# EAGLE schematic Schematic (EAGLE 9.7.0)
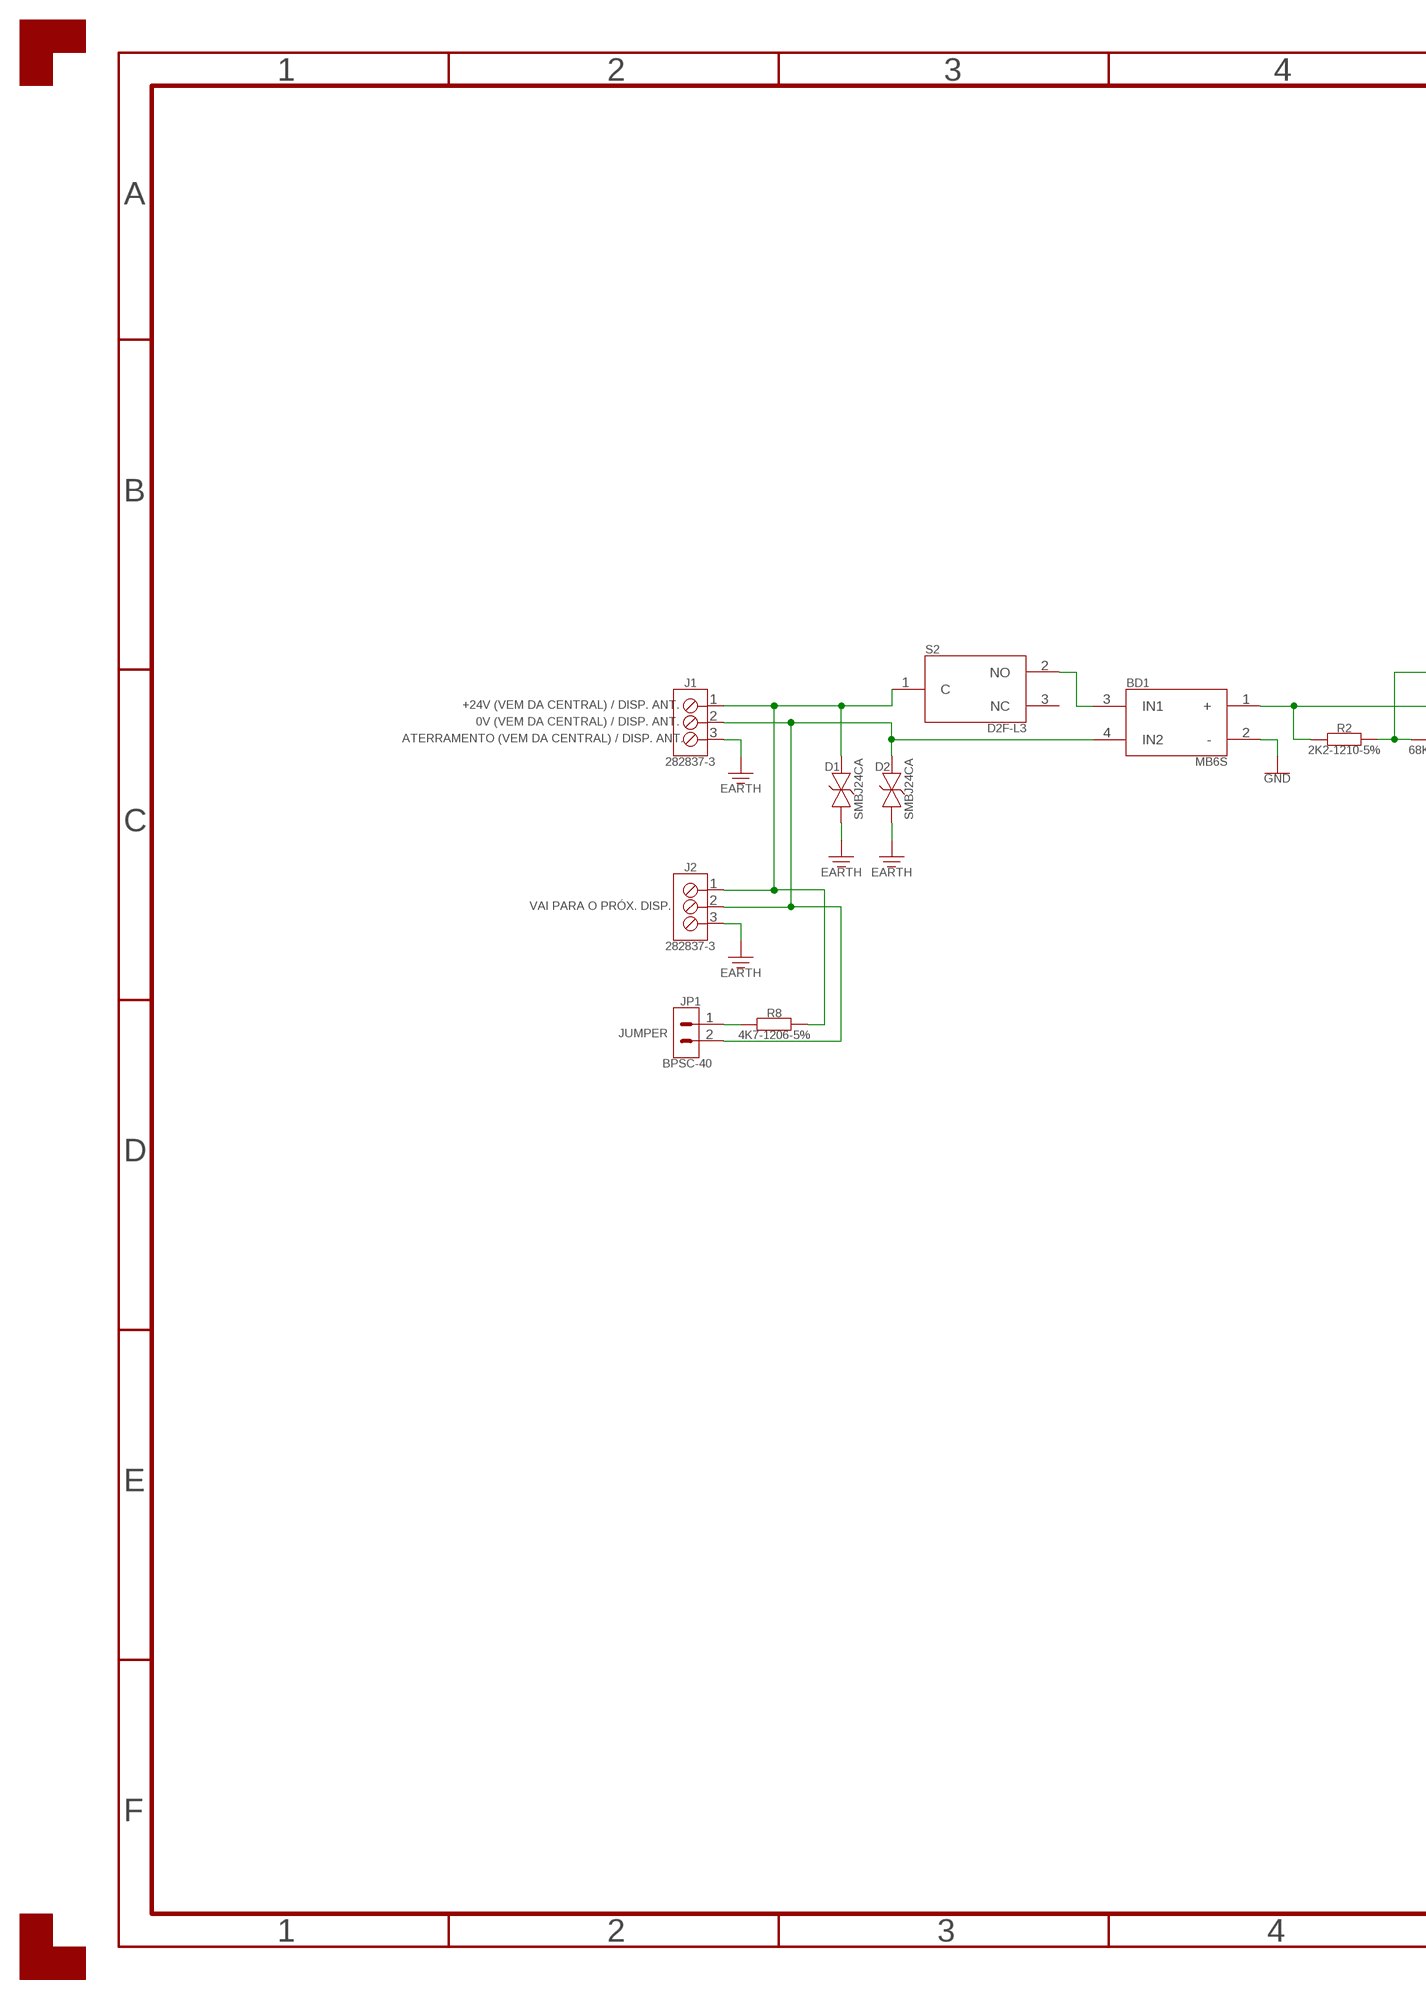
[diagram p0: schematic, sheet 1, part 1 of 2]
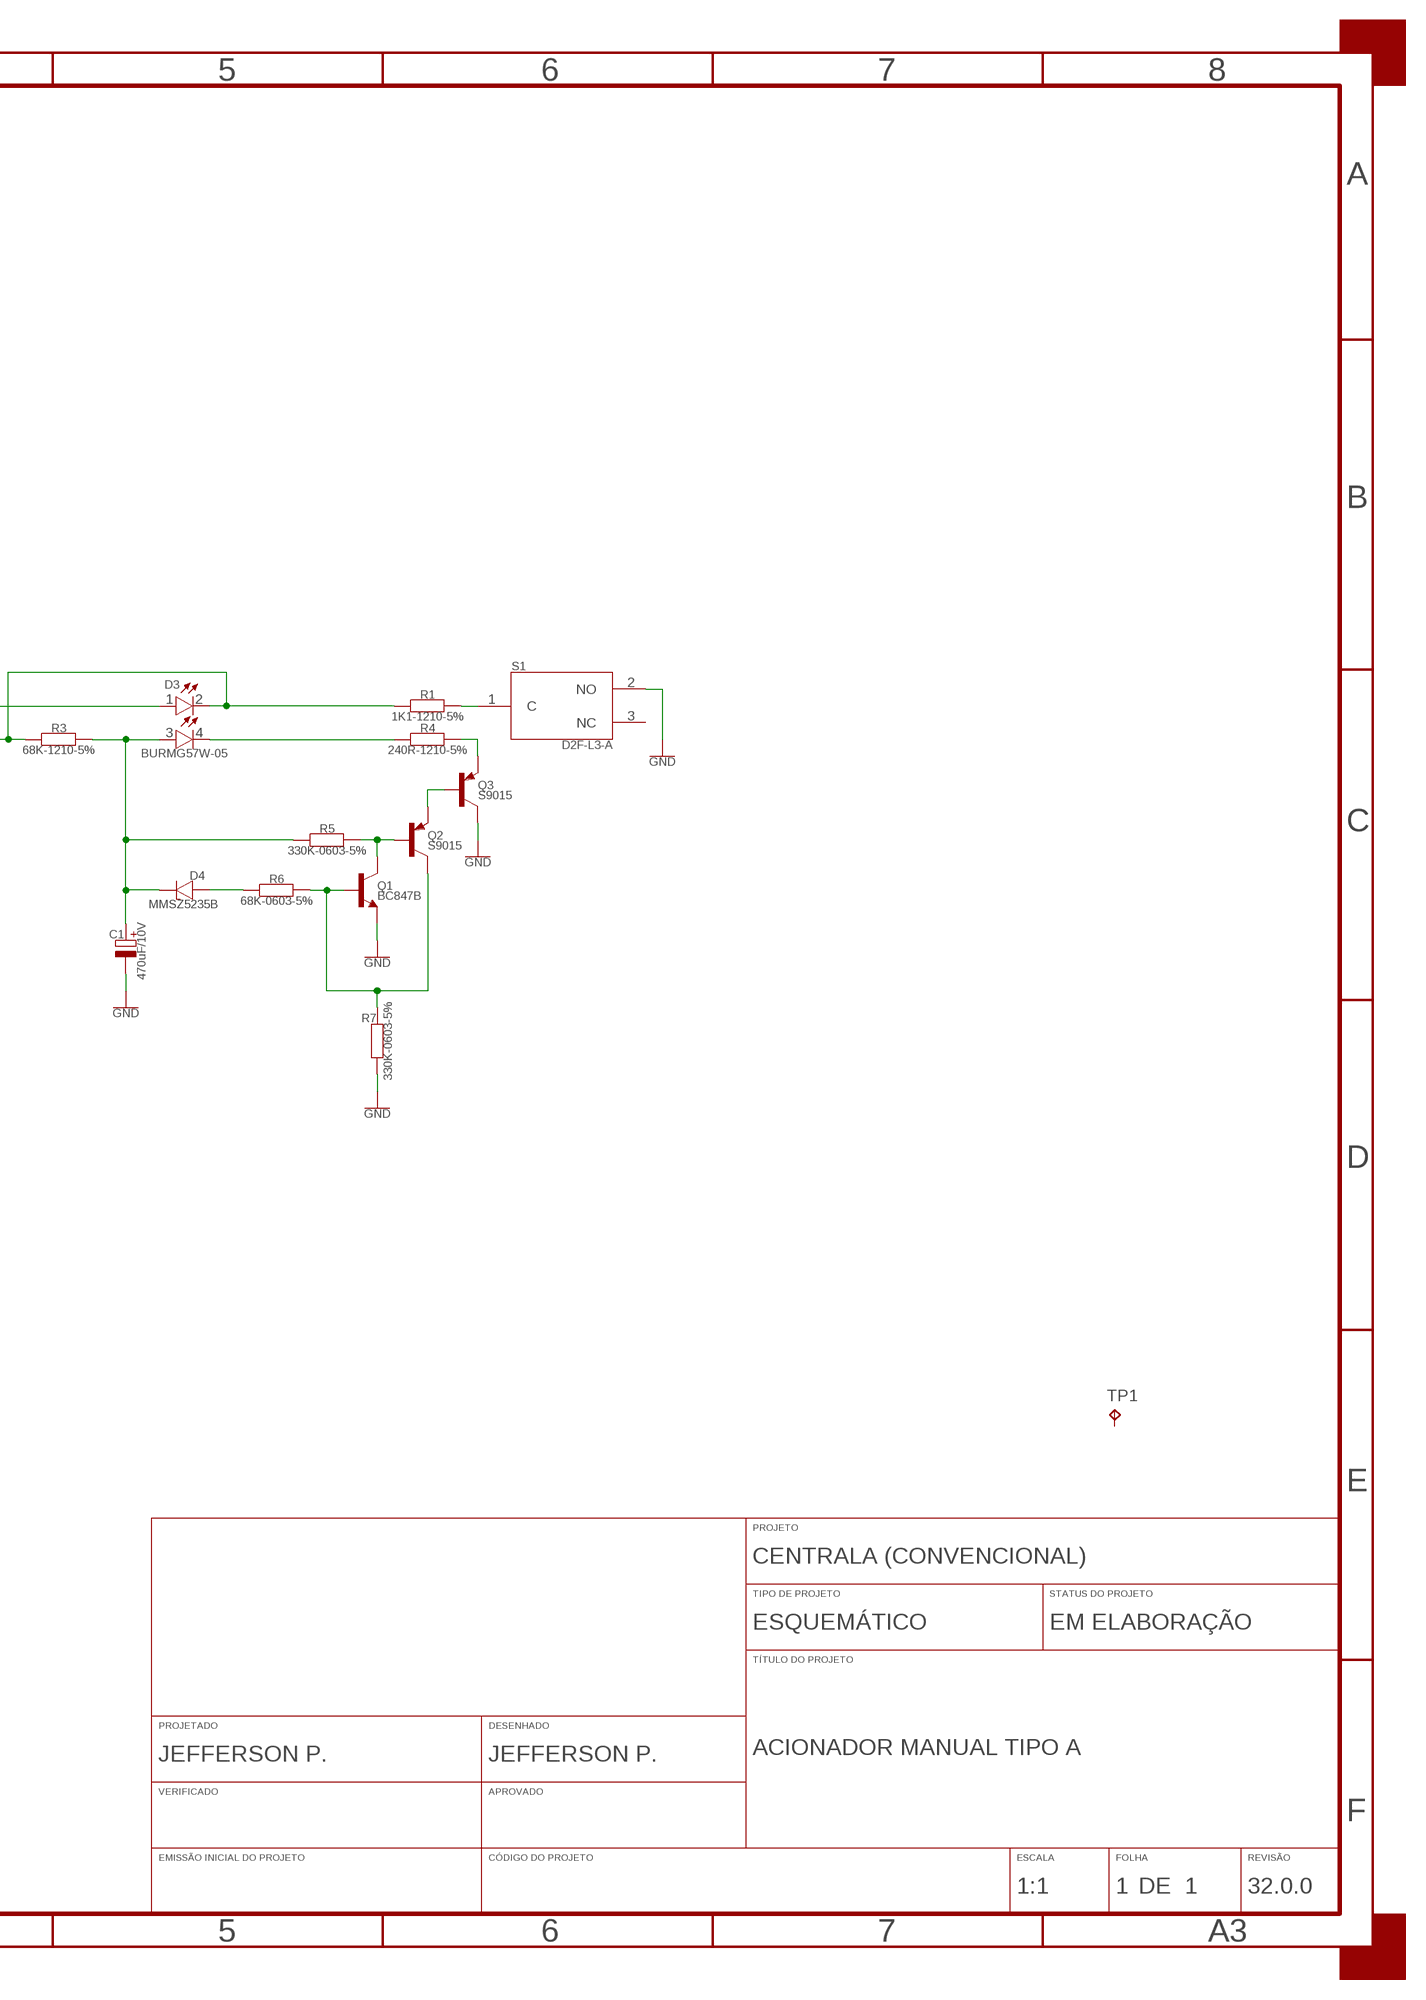
[diagram p1: schematic, sheet 1, part 2 of 2]

## Parts
BD1  MB6S  MB6SMB6S  [SOIC-4W]
C1  470uF/10V  C-POL_ECAP-8.5MM  [CAPAE830X1050N]
D1  SMBJ24CA  SMBJ24CASMBJ24CA  [DO-214AA]
D2  SMBJ24CA  SMBJ24CASMBJ24CA  [DO-214AA]
D3  BURMG57W-05  BURMG57W-05BURMG57W-05  [BI-1206]
D4  MMSZ5235B  MMSZ5235B-E3-08MMSZ5235B-E3-08  [SOD-123-2]
J1  282837-3  2828XX-3282837-3  [TERMBLK_508-3N]
J2  282837-3  2828XX-3282837-3  [TERMBLK_508-3N]
JP1  BPSC-40  PINHD-1X2  [1X02]
Q1  BC847B  BC847BBC847B  [SOT23-3]
Q2  S9015  S9015S9015  [SOT23-3]
Q3  S9015  S9015S9015  [SOT23-3]
R1  1K1-1210-5%  R_CHIP-1210(3225-METRIC)  [RESC3224X71]
R2  2K2-1210-5%  R_CHIP-1210(3225-METRIC)  [RESC3224X71]
R3  68K-1210-5%  R_CHIP-1210(3225-METRIC)  [RESC3224X71]
R4  240R-1210-5%  R_CHIP-1210(3225-METRIC)  [RESC3224X71]
R5  330K-0603-5%  R_CHIP-0603(1608-METRIC)  [RESC1608X60]
R6  68K-0603-5%  R_CHIP-0603(1608-METRIC)  [RESC1608X60]
R7  330K-0603-5%  R_CHIP-0603(1608-METRIC)  [RESC1608X60]
R8  4K7-1206-5%  R_CHIP-1206(3216-METRIC)  [RESC3216X70]
S1  D2F-L3-A  D2F-L3-AD2F-L3-A  [D2F-L3-A]
S2  D2F-L3  D2F-L3D2F-L3  [D2F-L3]
TP1  TPTP16R  [TP16R]

## Nets
EARTH: D1.A D2.A J1.3 J2.3
GND: BD1.2(-) C1.2(-) Q1.2(E) Q3.3(C) R7.1 S1.2(NO)
N$1: BD1.1(+) D3.1(A1) R2.1
N$2: BD1.3(IN1) S2.2(NO)
N$3: D3.2(C2) R1.1 R2.2 R3.1
N$4: JP1.1 R8.1
N$5: R1.2 S1.1(C)
N$6: C1.1(+) D3.3(A3) D4.C R3.2 R5.1
N$7: D3.4(C4) R4.1
N$8: Q1.1(B) Q2.3(C) R6.2 R7.2
N$9: Q1.3(C) Q2.1(B) R5.2
N$10: Q2.2(E) Q3.1(B)
N$11: Q3.2(E) R4.2
N$12: D4.A R6.1
N$13: BD1.4(IN2) D2.C J1.2 J2.2 JP1.2
N$14: D1.C J1.1 J2.1 R8.2 S2.1(C)
Unconnected: S1.3(NC) S2.3(NC) TP1.TP

## Notes on the sheet
- +24V (VEM DA CENTRAL) / DISP. ANT.
- 0V (VEM DA CENTRAL) / DISP. ANT.
- ATERRAMENTO (VEM DA CENTRAL) / DISP. ANT.
- 282837-3
- VAI PARA O PRÓX. DISP.
- 282837-3
- JUMPER
- CENTRALA (CONVENCIONAL)
- ESQUEMÁTICO | EM ELABORAÇÃO
- JEFFERSON P. | JEFFERSON P. | ACIONADOR MANUAL TIPO A
- 32.0.0

## Library data of the parts
BD1 = MB6S:MB6S: Passive bridge rectifier in small footprint 600V 0.5A; MANUFACTURER: Semiconductor Components Industries
C1 = Capacitor:C-POL: Capacitor Polarised - Generic; CATEGORY: Capacitor; PACKAGE_SIZE: 8.5MM; PACKAGE_TYPE: SMD; SUBCATEGORY: Aluminum Electrolytic Capacitors; TYPE: Radial Can
D1 D2 = SMBJ24CA:SMBJ24CA: TVS Bi-directional 600W 24V; MANUFACTURER: Littelfuse, Inc.
D3 = BURMG57W-05:BURMG57W-05: 0.5mm HIGH bicolor LED with ultra-thin design.; MANUFACTURER: NICOMATIC
D4 = MMSZ5235B-E3-08:MMSZ5235B-E3-08: Small Signal Zener Diode 6.8V 500mW; MANUFACTURER: Vishay; VALUE: MMSZ5235B-E3-08
J1 J2 = Connector:2828XX-3: 3 Position Wire to Board Terminal Block Horizontal with Board Reference: Datasheet <https://www.te.com.cn/commerce/DocumentDelivery/DDEController?Action=showdoc&DocId=Catalog+Section%7F1308389_EUROSTYLE_TERMINAL_BLOCKS%7F0607%7Fpdf%7FEnglish%7FENG_CS_1308389_EUROSTYLE_TERMINAL_BLOCKS_0607.pdf%7F2-282837-5>; CATEGORY: Connectors; DATASHEET: https://www.te.com/usa-en/product-282837-3.datasheet.pdf; DESCRIPTION: 3 Position Wire to Board Terminal Block Horizontal with Board 0.200" (5.08mm) Through Hole; MANUFACTURER: TE Connectivity AMP Connectors; MPN: 282837-3; OPERATING_TEMPERATURE: -40°C ~ 105°C; PACKAGE_SIZE: NA; PACKAGE_TYPE: Through Hole; PART_STATUS: Active; PITCH: 0.200" (5.08mm); ROHS: Compliant; SERIES: Buchanan; SUBCATEGORY: Terminal Block; TYPE: Screw Terminal - Rising Cage Clamp Side Wire Entry
JP1 = Connector:PINHD-1X2: Pin Header; CATEGORY: Connectors; DESCRIPTION: Header-Straight-2 Position; PACKAGE_TYPE: Through Hole; PITCH: 0.100" (2.54mm); SUBCATEGORY: Headers; TYPE: Male Pins
Q1 = BC847B:BC847B: 45 V, 100 mA NPN general-purpose transistor SOT23-3; MANUFACTURER: Nexperia B.V.
Q2 Q3 = S9015:S9015: -45 V, 100 mA PNP general-purpose transistor SOT23-3; MANUFACTURER: Secos Elektronische Bauelemente
R1-R4 = Resistor:R: Resistor Fixed - Generic; CATEGORY: Resistors; DESCRIPTION: Chip Resistor 3.20 X 2.49 X 0.71 mm body 1210(3225-METRIC) Package; PACKAGE_SIZE: 1210; PACKAGE_TYPE: SMD
R5-R7 = Resistor:R: Resistor Fixed - Generic; CATEGORY: Resistors; DESCRIPTION: Chip Resistor 1.60 X 0.82 X 0.60 mm body 0603(1608-METRIC) Package; PACKAGE_SIZE: 0603; PACKAGE_TYPE: SMD
R8 = Resistor:R: Resistor Fixed - Generic; CATEGORY: Resistors; DESCRIPTION: Chip Resistor 3.20 X 1.60 X 0.70 mm body 1206(3216-METRIC) Package; PACKAGE_SIZE: 1206; PACKAGE_TYPE: SMD
S1 = D2F-L3-A:D2F-L3-A: Ultra Subminiature Basic Switch 5.08 mm X R1.3 mm; MANUFACTURER: OMRON Corporation
S2 = D2F-L3:D2F-L3; MANUFACTURER: OMRON Corporation
TP1 = testpad:TP: Test pad